# Altium schematic sheet CC1101-CC1190.SchDoc
size 508 x 254 mm; Organization: Altium Limited; Address1: L3, 12a Rodborough Rd; Address2: Frenchs Forest; Address3: NSW; Address4: Australia 2086
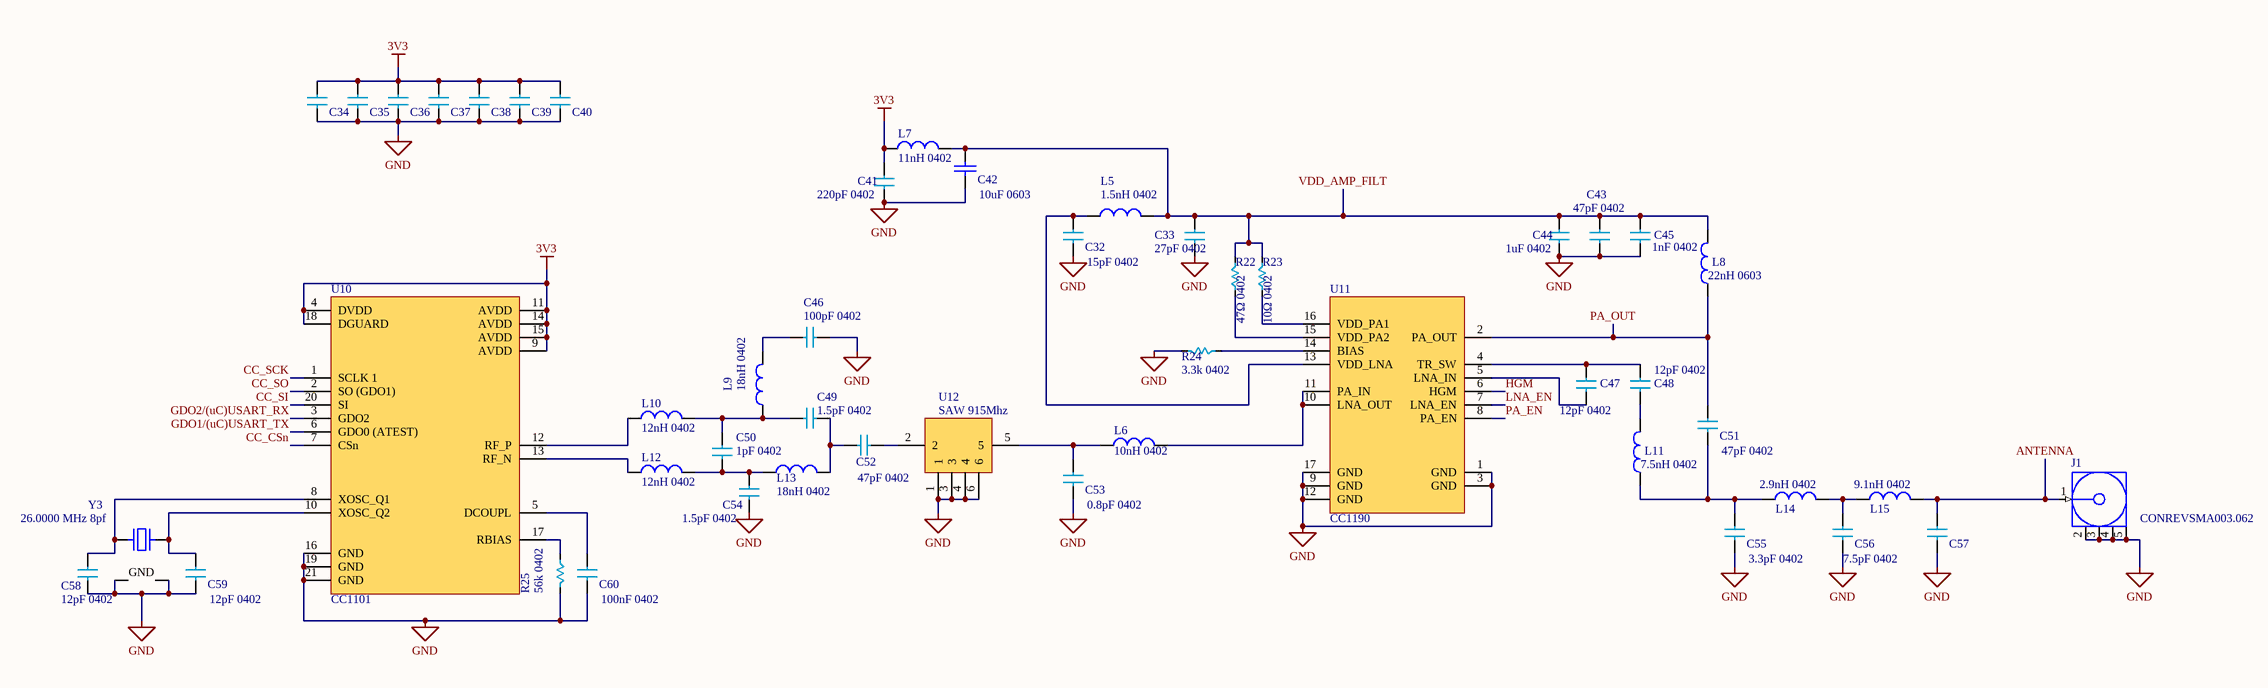
[diagram p0: CC1101-CC1190.SchDoc]

## Parts
C32  15pF 0402  [C0402]
C33  27pF 0402  [C0402]
C34  100nF 0402  [C0402]  (value not drawn)
C35  100nF 0402  [C0402]  (value not drawn)
C36  100nF 0402  [C0402]  (value not drawn)
C37  100nF 0402  [C0402]  (value not drawn)
C38  100nF 0402  [C0402]  (value not drawn)
C39  100nF 0402  [C0402]  (value not drawn)
C40  100nF 0402  [C0402]  (value not drawn)
C41  220pF 0402  [C0402]
C42  10uF 0603  [C0603]
C43  47pF 0402  [C0402]
C44  1uF 0402  [C0402]
C45  1nF 0402  [C0402]
C46  100pF 0402  [C0402]
C47  12pF 0402  [C0402]
C48  12pF 0402  [C0402]
C49  1.5pF 0402  [C0402]
C50  1pF 0402  [C0402]
C51  47pF 0402  [C0402]
C52  47pF 0402  [C0402]
C53  0.8pF 0402  [C0402]
C54  1.5pF 0402  [C0402]
C55  3.3pF 0402  [C0402]
C56  7.5pF 0402  [C0402]
C57  Placeholder  [C0402]  (value not drawn)
C58  12pF 0402  [C0402]
C59  12pF 0402  [C0402]
C60  100nF 0402  [C0402]
J1  CONREVSMA003.062  [CON-SMA-EDGE062]
L5  1.5nH 0402  [L0402]
L6  10nH 0402  [L0402]
L7  11nH 0402  [L0402]
L8  22nH 0603  [L0603]
L9  18nH 0402  [L0402]
L10  12nH 0402  [L0402]
L11  7.5nH 0402  [L0402]
L12  12nH 0402  [L0402]
L13  18nH 0402  [L0402]
L14  2.9nH 0402  [L0402]
L15  9.1nH 0402  [L0402]
R22  47Ω 0402  [R0402]
R23  10Ω 0402  [R0402]
R24  3.3k 0402  [R0402]
R25  56k 0402  [R0402]
U10  CC1101  [QFN20-TI]
U11  CC1190  [QFN16-TI]
U12  SAW 915Mhz  [DCC6C]
Y3  26.0000 MHz 8pf  [NDK NX3225GA]

## Nets
3V3: C34.2 C35.2 C36.2 C37.2 C38.2 C39.2 C40.2 C41.1 L7.1 U10.4(DVDD) U10.9(AVDD) U10.11(AVDD) U10.14(AVDD) U10.15(AVDD) U10.18(DGUARD)
GND: C32.2 C33.2 C34.1 C35.1 C36.1 C37.1 C38.1 C39.1 C40.1 C41.2 C42.1 C43.2 C44.2 C45.2 C46.1 C53.2 C54.1 C55.2 C56.2 C57.2 C58.1 C59.1 C60.1 J1.2(GND) J1.3(GND) J1.4(GND) J1.5(GND) R24.1 R25.1 U10.16(GND) U10.19(GND) U10.21(GND) U11.1(GND) U11.3(GND) U11.9(GND) U11.12(GND) U11.17(GND) U12.1 U12.3 U12.4 U12.6 Y3.2(GND) Y3.4(GND)
ANTENNA: C57.1 J1.1(Signal) L15.2
CC_CSn: U10.7(CSn)
CC_SCK: U10.1(SCLK_1)
CC_SI: U10.20(SI)
CC_SO: U10.2(SO_(GDO1))
GDO1/(uC)USART_TX: U10.6(GDO0_(ATEST))
GDO2/(uC)USART_RX: U10.3(GDO2)
HGM: U11.6(HGM)
LNA_EN: U11.7(LNA_EN)
PA_EN: U11.8(PA_EN)
PA_OUT: C51.1 L8.1 U11.2(PA_OUT)
VDD_AMP_FILT: C33.1 C42.2 C43.1 C44.1 C45.1 L5.2 L7.2 L8.2 R22.1 R23.1
NetC32_1: C32.1 L5.1 U11.13(VDD_LNA)
NetC46_2: C46.2 L9.2
NetC47_1: C47.1 C48.1 U11.4(TR_SW)
NetC47_2: C47.2 U11.5(LNA_IN)
NetC48_2: C48.2 L11.2
NetC49_1: C49.1 C50.2 L9.1 L10.2
NetC49_2: C49.2 C52.1 L13.2
NetC50_1: C50.1 C54.2 L12.2 L13.1
NetC51_2: C51.2 C55.1 L11.1 L14.1
NetC52_2: C52.2 U12.2
NetC53_1: C53.1 L6.1 U12.5
NetC56_1: C56.1 L14.2 L15.1
NetC58_2: C58.2 U10.8(XOSC_Q1) Y3.1
NetC59_2: C59.2 U10.10(XOSC_Q2) Y3.3
NetC60_2: C60.2 U10.5(DCOUPL)
NetL6_2: L6.2 U11.10(LNA_OUT) U11.11(PA_IN)
NetL10_1: L10.1 U10.12(RF_P)
NetL12_1: L12.1 U10.13(RF_N)
NetR22_2: R22.2 U11.15(VDD_PA2)
NetR23_2: R23.2 U11.16(VDD_PA1)
NetR24_2: R24.2 U11.14(BIAS)
NetR25_2: R25.2 U10.17(RBIAS)

## Notes on the sheet
- Title
- Size:
- Date:
- A4
- Number:
- Time:
- Revision:
- Sheet
- of
- File:

## Library data of the parts
C32 = C0402-15pF
C33 = C0402-27pF
C34-C40 C60 = C0402-100nF
C41 = C0402-220pF
C42 = C-10.0uF-0603
C43 C51 C52 = C0402-47pF
C44 = C0402-1uF
C45 = C0402-1nF
C46 = C0402-100pF
C47 C48 C58 C59 = C0402-12pF
C49 C54 = C0402-1.5pF
C50 = C0402-1pF
C53 = C0402-0.8pF
C55 = C0402-3.3pF
C56 = C0402-7.5pF
C57 = C0402-?: Placeholder Cap
J1 = CONREVSMA003.062: RP-SMA Female Edge Mount Connector for 0.062" Thick Board; PCB_Layout: Pads complies with manufacturer's recommendation.; PackageVersion: rev1.0, Jun-2006; DatasheetVersion: rev1.0, Jun-2006; PackageDescription: SMA Female Edge Mount for Connector 0.062" Thick Board, Reverse-polarity, 7.9 mm Body Dia.; PackageReference: CON-SMA-EDGE062; PartNumber: CONREVSMA003.062
L5 = L0402-1.5nH
L6 = L0402-10nH
L7 = L0402-11nH
L8 = L0603-22nH
L9 L13 = L0402-18nH
L10 L12 = L0402-12nH
L11 = L0402-7.5nH
L14 = L0402-2.9
L15 = L0402-9.1nH
R22 = R-47-0402
R23 = R-10-0402
R24 = R-3.3k-0402
R25 = R-56k-0402
U10 = CC1101: RF Transceiver IC
U11 = CC1190: RF frontend
U12 = B39921B3726U410: FILTER SAW 915MHZ REMOTE SMD; Manufacturer: TDK EPCOS; Load Impedance: 50R; Bandwidth: 10MHz; Insertion Loss: 2.6dB; Supplier 1: Newark; RoHS: Yes; Category: EMI / RFI Components; Mount: Surface Mount; Case/Package: SMD/SMT; Number of Pins: 6; Min Operating Temperature: -45°C; Max Operating Temperature: 125°C; Package Quantity: 9000; Frequency: 915MHz; Impedance: 50R; Packaging: Tape and Reel; Termination: SMD/SMT; Series: *; Length: 3mm; Width: 0.118inch; Height: 1.1mm; Ratings: AEC-Q200; Radiation Hardening: No; Lead Free: Lead Free; ComponentLink1URL: https://datasheet.ciiva.com/3073/b3726-3073185.pdf?src-supplier=Avnet; ComponentLink1Description: https://datasheet.ciiva.com/3073/b3726-3073185.pdf?src-supplier=Avnet; ComponentLink2URL: https://datasheet.ciiva.com/4548/b3726-58910-4548209.pdf?src-supplier=Mouser; ComponentLink2Description: https://datasheet.ciiva.com/4548/b3726-58910-4548209.pdf?src-supplier=Mouser; ComponentLink3URL: https://datasheet.ciiva.com/15161/getdatasheetpartid-330732-15161563.pdf?src-supplier=Verical; ComponentLink3Description: https://datasheet.ciiva.com/15161/getdatasheetpartid-330732-15161563.pdf?src-supplier=Verical; ComponentLink4URL: https://datasheet.ciiva.com/16628/b3726-16628731.pdf?src-supplier=Avnet+Europe; ComponentLink4Description: https://datasheet.ciiva.com/16628/b3726-16628731.pdf?src-supplier=Avnet+Europe; ComponentLink5URL: https://datasheet.ciiva.com/6203/b3726-6203485.pdf?src-supplier=Digi-Key; ComponentLink5Description: https://datasheet.ciiva.com/6203/b3726-6203485.pdf?src-supplier=Digi-Key; Supplier Part Number 1: 50R8492; Manufacturer Part Number: B39921B3726U410
Y3 = NX3225SA-26.000M-STD-CSR-3: Crystal 26MHz 8pF 4-Pin SMD; Manufacturer: NDK; ESR (Equivalent Series Resistance): 50R; Frequency Stability: 15ppm; Supplier 1: Digi-Key; RoHS: Yes; Category: Crystals; Stock 1: 11873; Pricing 1: 1=0.99000, 10=0.87400, 50=0.81700, 100=0.72200, 500=0.68400, 1000=0.57000 (USD); Mount: Surface Mount; Case/Package: SMD/SMT; Number of Pins: 4; Min Operating Temperature: -10°C; Max Operating Temperature: 75°C; Frequency: 26MHz; Packaging: Tape and Reel; Load Capacitance: 8pF; Frequency Tolerance: 15ppm; Length: 0.126inch; Width: 0.098inch; Height: 0.024inch; Lead Free: Lead Free; ComponentLink1URL: https://datasheet.ciiva.com/18026/getdatasheetpartid-683563-18026983.pdf?src-supplier=Verical; ComponentLink1Description: https://datasheet.ciiva.com/18026/getdatasheetpartid-683563-18026983.pdf?src-supplier=Verical; Supplier Part Number 1: 644-1270-1-ND; Manufacturer Part Number: NX3225SA-26.000M-STD-CSR-3